# Altium schematic sheet CODEC.SchDoc
size A4
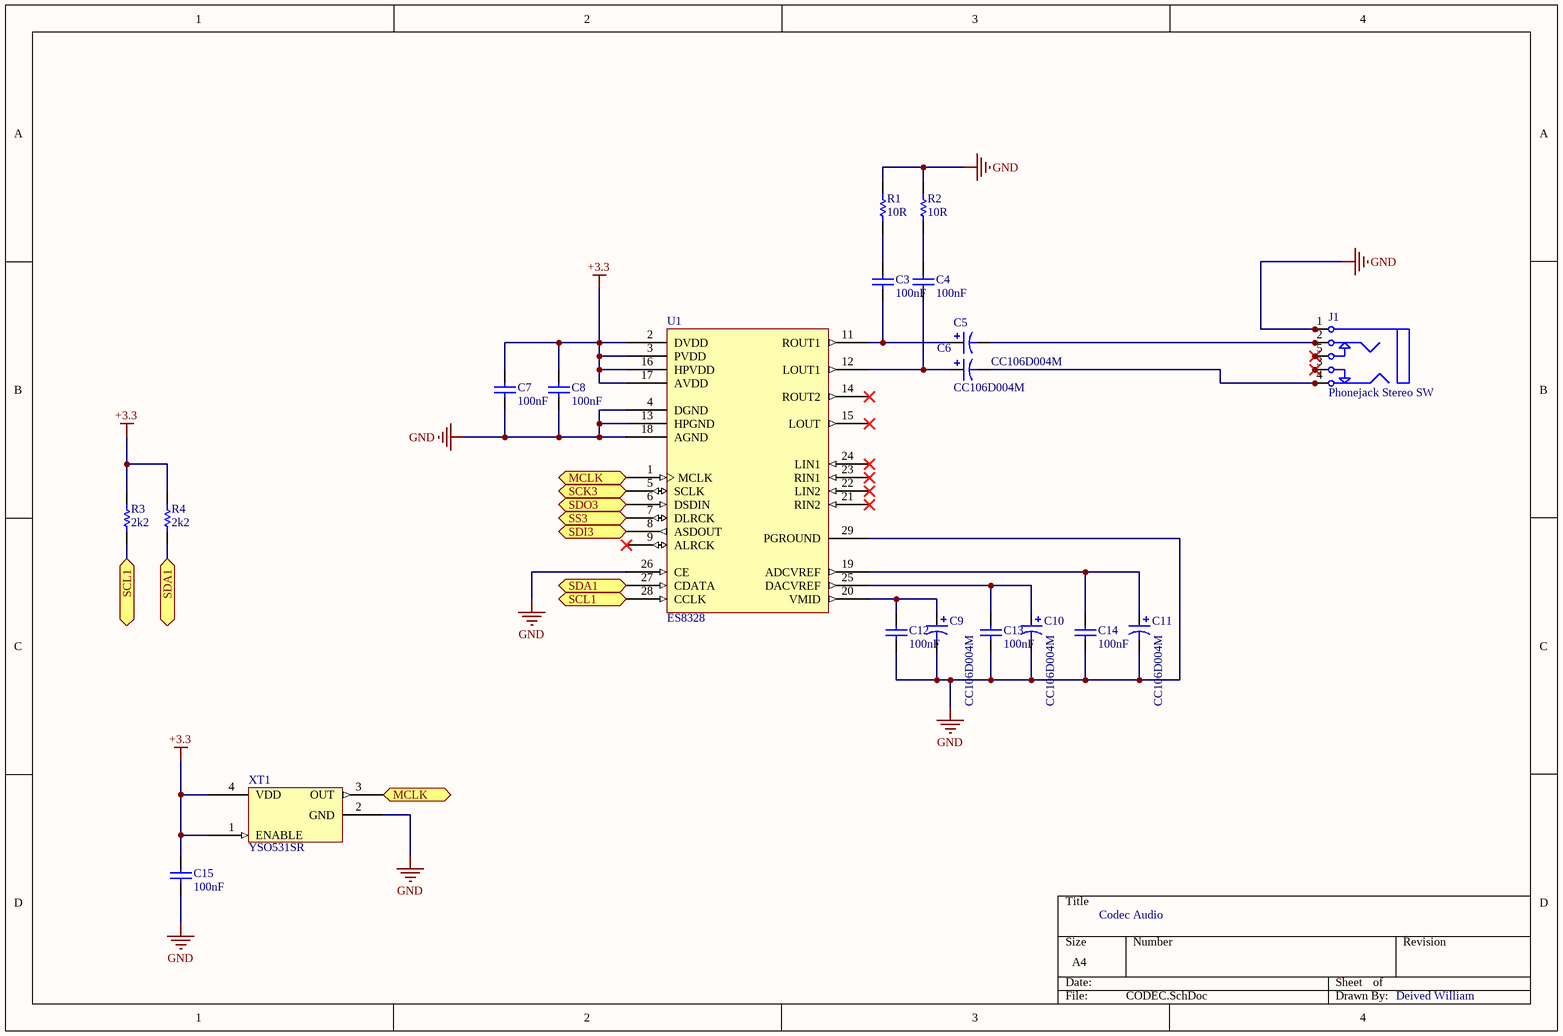
[diagram p0: CODEC.SchDoc]

## Parts
C3  value 100nF  [WCAP-CSGP_0603, 1.6x0.8x0.8mm_Reflow]  (hidden comment: 885012206020)
C4  value 100nF  [WCAP-CSGP_0603, 1.6x0.8x0.8mm_Reflow]  (hidden comment: 885012206020)
C5  CC106D004M  [D]
C6  CC106D004M  [D]
C7  value 100nF  [WCAP-CSGP_0603, 1.6x0.8x0.8mm_Reflow]  (hidden comment: 885012206020)
C8  value 100nF  [WCAP-CSGP_0603, 1.6x0.8x0.8mm_Reflow]  (hidden comment: 885012206020)
C9  CC106D004M  [D]
C10  CC106D004M  [D]
C11  CC106D004M  [D]
C12  value 100nF  [WCAP-CSGP_0603, 1.6x0.8x0.8mm_Reflow]  (hidden comment: 885012206020)
C13  value 100nF  [WCAP-CSGP_0603, 1.6x0.8x0.8mm_Reflow]  (hidden comment: 885012206020)
C14  value 100nF  [WCAP-CSGP_0603, 1.6x0.8x0.8mm_Reflow]  (hidden comment: 885012206020)
C15  value 100nF  [WCAP-CSGP_0603, 1.6x0.8x0.8mm_Reflow]  (hidden comment: 885012206020)
J1  Phonejack Stereo SW  [ST-3150-5N]
R1  10R  [3-0603]
R2  10R  [3-0603]
R3  2k2  [3-0603]
R4  2k2  [3-0603]
U1  ES8328  [QFN-28L]
XT1  YSO531SR  [CRISTAL]

## Ports
MCLK, SCK3, SCL1, SDA1, SDI3, SDO3, SS3

## Nets
+3.3: C7.2 C8.2 C15.1 R3.2 R4.2 U1.2(DVDD) U1.3(PVDD) U1.16(HPVDD) U1.17(AVDD) XT1.1(ENABLE) XT1.4(VDD)
GND: C7.1 C8.1 C9.2 C10.2 C11.2 C12.1 C13.1 C14.1 C15.2 J1.1 J1.1A J1.1B R1.2 R2.2 U1.4(DGND) U1.13(HPGND) U1.18(AGND) U1.26(CE) U1.29(PGROUND) XT1.2(GND)
MCLK: U1.1(MCLK) XT1.3(OUT) ; port MCLK
SCK3: U1.5(SCLK) ; port SCK3
SCL1: R3.1 U1.28(CCLK) ; port SCL1
SDA1: R4.1 U1.27(CDATA) ; port SDA1
SDI3: U1.8(ASDOUT) ; port SDI3
SDO3: U1.6(DSDIN) ; port SDO3
SS3: U1.7(DLRCK) ; port SS3
NetC3_1: C3.1 C5.1 U1.11(ROUT1)
NetC3_2: C3.2 R1.1
NetC4_1: C4.1 C6.1 U1.12(LOUT1)
NetC4_2: C4.2 R2.1
NetC5_2: C5.2 J1.2 J1.2A J1.2B
NetC6_2: C6.2 J1.4 J1.4A J1.4B
NetC9_1: C9.1 C12.2 U1.20(VMID)
NetC10_1: C10.1 C13.2 U1.25(DACVREF)
NetC11_1: C11.1 C14.2 U1.19(ADCVREF)
NetJ1_3: J1.3 J1.3A J1.3B
NetJ1_5: J1.5 J1.5A J1.5B

Not connected (* = marked no-connect by the designer): U1 9(ALRCK)* 14(ROUT2)* 15(LOUT)* 21(RIN2)* 22(LIN2)* 23(RIN1)* 24(LIN1)*

## Notes on the sheet
- Codec Audio
- Deived William

## Library data of the parts
C3 C4 C7 C8 C12-C15 = 885012206020: WCAP-CSGP Ceramic Capacitors, size 0603, 1.6x0.8x0.8mm, 10V, X7R, 100nF; Rated Voltage: 10V DC; ComponentLink1Description: Manufacturer; ComponentLink1URL: http://www.we-online.de; ComponentLink2Description: Datasheet; ComponentLink2URL: http://katalog.we-online.de/pbs/datasheet/885012206020.pdf; Part Number: 885012206020; Published Date: June 2017; Publisher: Wurth Elektronik; Size: 0603, 1.6x0.8x0.8mm; Ceramic Type: X7R
C5 C6 C9-C11 = CC106D004M: Conformal Coated Solid Tantalum Chip Capacitor: Standard Range, 10uF, 20% Tolerance, 4 WVDC @ -55°C to +85°C, Surge = 5V; Note: See Data Sheet for full range of components; Published: 19-Mar-2004; DatasheetDocument: 21-Mar-2002; PackageReference: D; Publisher: Altium Limited; ComponentLink1Description: Manufacturer Link; ComponentLink1URL: http://www.vishay.com/; ComponentLink2Description: Datasheet; ComponentLink2URL: http://www.vishay.com/docs/43017/ccec.pdf; Value: 10uF
J1 = Phonejack Stereo SW: 3-Conductor Jack with 2 break contacts (normals) and 2 auxiliary make contacts; Published: 5-Jan-2004; LatestRevisionDate: 17-Dec-2003; LatestRevisionNote: PCB Footprint replaced.; DatasheetDocument: 07-Mar-2000; Publisher: Altium Limited; ComponentLink1Description: Manufacturer Link; ComponentLink1URL: http://domino.kycon.com/internet/Products.html
R1-R4 = ERJ3RE: Precision Thick Film Chip Resistor, 10 Ohm to 1M Ohm Range, 1% and 0.5% Tolerance, 0603 Size, 0.063 W; Published: 17-Dec-2003; LatestRevisionDate: 19-Mar-2004; LatestRevisionNote: Silkscreen size reduced.; PackageDocument: Mar-2003; PackageReference: 3-0603; Publisher: Altium Limited; Code_IPC: 1608 [0603]; ComponentLink1Description: Manufacturer Link; ComponentLink1URL: http://www.panasonic.com/industrial/components/resistive_products.htm; ComponentLink2Description: Datasheet; ComponentLink2URL: http://www.panasonic.com/industrial/components/pdf/AOA0000CE2.pdf
U1 = ES8328: Low Power Estereo Audio Codec With HeadPhone Amplifier
XT1 = YSO531SR: Cristal Oscilator Active 1.8v - 3.3v